# EAGLE schematic ECE445-Receiver-Schematic (EAGLE 7.5.0)
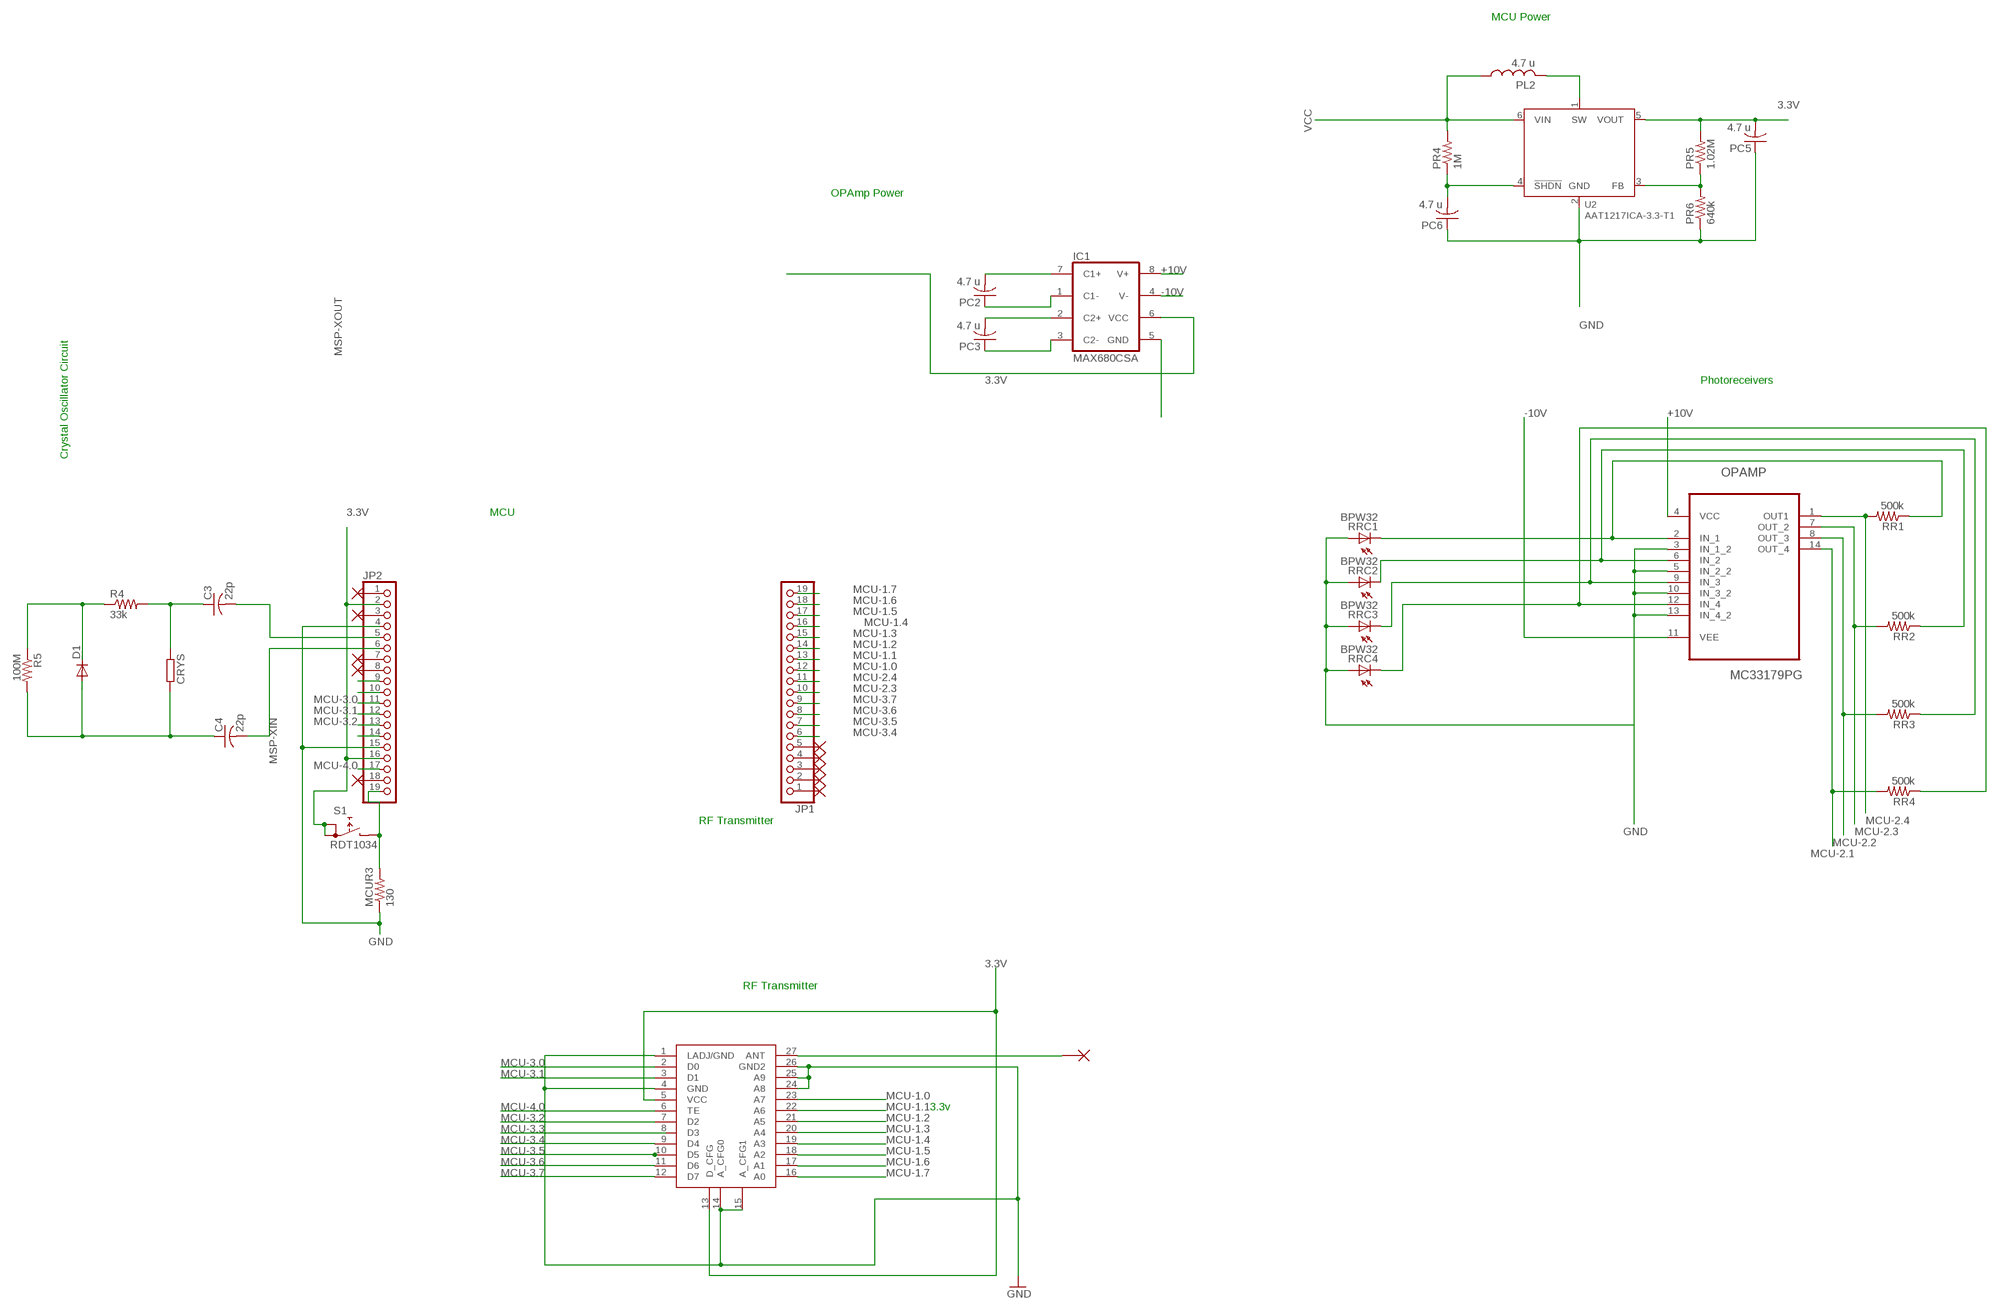
[diagram p0: schematic, sheet 1]

## Parts
C3  22p  C-US025-024X044  [C025-024X044]
C4  22p  C-US025-024X044  [C025-024X044]
CRYS  R-EU_0204/5  [0204/5]
D1  1N4004  [DO41-10]
IC1  MAX680CSA  [SO08]
JP1  PINHD-1X19  [1X19]
JP2  PINHD-1X19  [1X19]
MCUR3  130  R-US_0204/5  [0204/5]
OPAMP  MC33179PG  [DIP254P762X469-14]
PC2  4.7 u  C-US025-024X044  [C025-024X044]
PC3  4.7 u  C-US025-024X044  [C025-024X044]
PC5  4.7 u  C-US025-024X044  [C025-024X044]
PC6  4.7 u  C-US025-024X044  [C025-024X044]
PL2  4.7 u  L-US0204/5  [0204/5]
PR4  1M  R-US_0204/5  [0204/5]
PR5  1.02M  R-US_0204/5  [0204/5]
PR6  640k  R-US_0204/5  [0204/5]
R4  33k  R-US_0204/2V  [0204V]
R5  100M  R-US_0204/2V  [0204V]
RR1  500k  R-US_0204/5  [0204/5]
RR2  500k  R-US_0204/5  [0204/5]
RR3  500k  R-US_0204/5  [0204/5]
RR4  500k  R-US_0204/5  [0204/5]
RRC1  BPW32  [BPW32]
RRC2  BPW32  [BPW32]
RRC3  BPW32  [BPW32]
RRC4  BPW32  [BPW32]
S1  RDT1034  [RDT1034]
U2  AAT1217ICA-3.3-T1  [TSOT-23-6]
U$1  LINX-KH3-TRANSMITTER  [LINX-KH3-TRANSMITTER]
U$2  NO_CONNECT  [NO_CONNECT]
U$3  NO_CONNECT  [NO_CONNECT]
U$4  NO_CONNECT  [NO_CONNECT]
U$5  NO_CONNECT  [NO_CONNECT]
U$6  NO_CONNECT  [NO_CONNECT]
U$7  NO_CONNECT  [NO_CONNECT]
U$8  NO_CONNECT  [NO_CONNECT]
U$9  NO_CONNECT  [NO_CONNECT]
U$10  NO_CONNECT  [NO_CONNECT]
U$11  NO_CONNECT  [NO_CONNECT]
U$12  NO_CONNECT  [NO_CONNECT]

## Nets
3.3V: IC1.6(VCC) JP2.2 JP2.16 PC5.2 PR5.2 S1.A S1.A1 U2.5(VOUT) U$1.5(VCC) U$1.13(D_CFG)
+10V: IC1.8(V+) OPAMP.4(VCC)
-10V: IC1.4(V-) OPAMP.11(VEE)
GND: IC1.5(GND) JP2.4 JP2.15 MCUR3.1 OPAMP.3(IN_1_2) OPAMP.5(IN_2_2) OPAMP.10(IN_3_2) OPAMP.13(IN_4_2) PC5.1 PC6.1 PR6.1 RRC1.A RRC2.A RRC3.A RRC4.A U2.2(GND) U$1.1(LADJ/GND) U$1.4(GND) U$1.14(A_CFG0) U$1.15(A_CFG1) U$1.24(A8) U$1.25(A9) U$1.26(GND2)
MCU-1.0: JP1.12 U$1.23(A7)
MCU-1.1: JP1.13 U$1.22(A6)
MCU-1.2: JP1.14 U$1.21(A5)
MCU-1.3: JP1.15 U$1.20(A4)
MCU-1.4: JP1.16 U$1.19(A3)
MCU-1.5: JP1.17 U$1.18(A2)
MCU-1.6: JP1.18 U$1.17(A1)
MCU-1.7: JP1.19 U$1.16(A0)
MCU-2.1: JP2.9 OPAMP.14(OUT_4) RR4.2
MCU-2.2: JP2.10 OPAMP.8(OUT_3) RR3.2
MCU-2.3: JP1.10 OPAMP.7(OUT_2) RR2.2
MCU-2.4: JP1.11 OPAMP.1(OUT1) RR1.2
MCU-3.0: JP2.11 U$1.2(D0)
MCU-3.1: JP2.12 U$1.3(D1)
MCU-3.2: JP2.13 U$1.7(D2)
MCU-3.3: JP2.14
MCU-3.4: JP1.6 U$1.9(D4)
MCU-3.5: JP1.7 U$1.10(D5)
MCU-3.6: JP1.8 U$1.11(D6)
MCU-3.7: JP1.9 U$1.12(D7)
MCU-4.0: JP2.17 U$1.6(TE)
MSP-XIN: C4.2 JP2.6
MSP-XOUT: C3.2 JP2.5
N$1: IC1.7(C1+) PC2.2
N$2: PC6.2 PR4.1 U2.4(!SHDN)
N$3: IC1.2(C2+) PC3.2
N$7: JP2.19 MCUR3.2 S1.B
N$8: C3.1 CRYS.1 R4.2
N$9: D1.C R4.1 R5.1
N$10: OPAMP.6(IN_2) RR2.1 RRC2.K(C)
N$11: C4.1 CRYS.2 D1.A R5.2
N$14: OPAMP.9(IN_3) RR3.1 RRC3.K(C)
N$30: U$1.27(ANT)
PC2: IC1.1(C1-) PC2.1
PC3: IC1.3(C2-) PC3.1
POWERL2: PL2.2 U2.1(SW)
POWERR1: PR5.1 PR6.2 U2.3(FB)
RRC1: OPAMP.2(IN_1) RR1.1 RRC1.K(C)
RRC4: OPAMP.12(IN_4) RR4.1 RRC4.K(C)
VCC: PL2.1 PR4.2 U2.6(VIN)
Unconnected: JP1.1 JP1.2 JP1.3 JP1.4 JP1.5 JP2.1 JP2.3 JP2.7 JP2.8 JP2.18 U$1.8(D3) U$2.P$1(NC) U$3.P$1(NC) U$4.P$1(NC) U$5.P$1(NC) U$6.P$1(NC) U$7.P$1(NC) U$8.P$1(NC) U$9.P$1(NC) U$10.P$1(NC) U$11.P$1(NC) U$12.P$1(NC)

## Notes on the sheet
- MCU Power
- OPAmp Power
- Crystal Oscillator Circuit
- Photoreceivers
- MCU
- RF Transmitter
- RF Transmitter
- 3.3v

## Library data of the parts
C3 C4 PC2 PC3 PC5 PC6 = rcl:C-US: CAPACITOR, American symbol
CRYS = rcl:R-EU_: RESISTOR, European symbol
D1 = diode:1N4004: DIODE general purpose rectifier, 1 A
IC1 = maxim:MAX680CSA: Switched-capcitor VOLTAGE CONVERTER; MF: MAXIM; MPN: MAX680CSA; OC_FARNELL: 9725717; OC_NEWARK: 34C3975
JP1 JP2 = pinhead:PINHD-1X19: PIN HEADER
MCUR3 PR4-PR6 R4 R5 RR1-RR4 = rcl:R-US_: RESISTOR, American symbol
OPAMP = ON Semiconductor_By_element14_Batch_1:MC33179PG: Operational Amplifiers; MPN: MC33179PG; OC_FARNELL: 9666826; OC_NEWARK: 26K4013; PACKAGE: PDIP-14; SUPPLIER: On Semiconductor
PL2 = rcl:L-US: INDUCTOR, American symbol
RRC1-RRC4 = opto-trans-siemens:BPW32: PHOTO DIODE; OC_FARNELL: unknown; OC_NEWARK: unknown
S1 = switch:RDT1034: PUSH SWITCH www.radiohm.com
U2 = Skyworks:AAT1217
U$1 = Linx-KH3-Transmitter:LINX-KH3-TRANSMITTER
U$2-U$12 = NO_CONNECT:NO_CONNECT

## Module PHOTORECEIVER
Ports: IN(io) OUT(io)

### Library data of the parts